# EAGLE schematic OPA_BOARD_V2 (EAGLE 7.5.0)
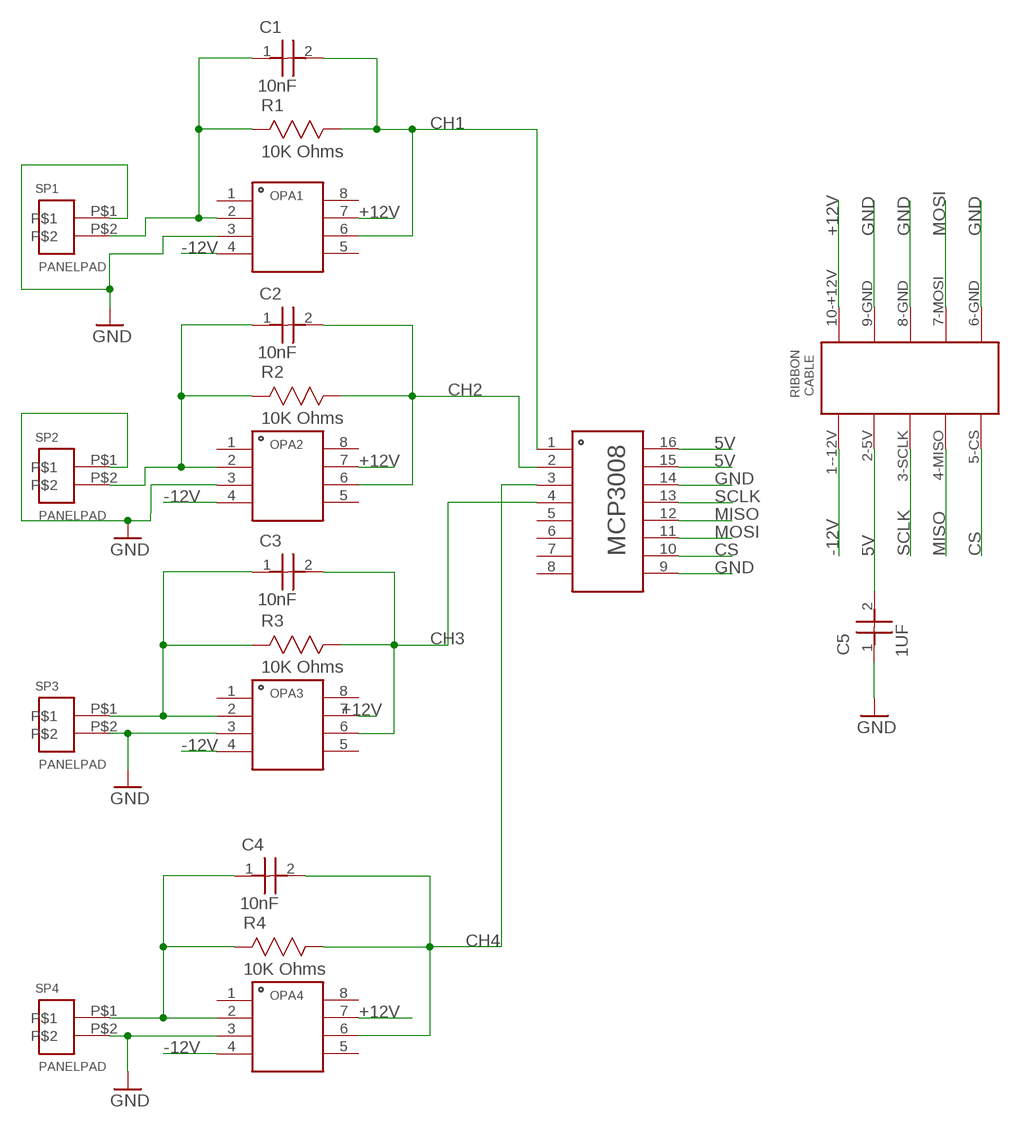
[diagram p0: schematic, sheet 1]

## Parts
ADC  MCP3008-SOIC16  [SOIC16N]
C1  10nF  CAP1206  [CAP1206]
C2  10nF  CAP1206  [CAP1206]
C3  10nF  CAP1206  [CAP1206]
C4  10nF  CAP1206  [CAP1206]
C5  1UF  CAP1206  [CAP1206]
OPA1  THS4631-SOIC8  [SOIC8]
OPA2  THS4631-SOIC8  [SOIC8]
OPA3  THS4631-SOIC8  [SOIC8]
OPA4  THS4631-SOIC8  [SOIC8]
R1  10K Ohms  RES1206  [RES1206]
R2  10K Ohms  RES1206  [RES1206]
R3  10K Ohms  RES1206  [RES1206]
R4  10K Ohms  RES1206  [RES1206]
SP1  PANELPAD  [PANELPADS]
SP2  PANELPAD  [PANELPADS]
SP3  PANELPAD  [PANELPADS]
SP4  PANELPAD  [PANELPADS]
U$1  5X2RIBBONCONNECTOR  [5X2RIBBONCONNECTOR]

## Nets
5V: ADC.15(15-VREF) ADC.16(16-VDD) C5.2 U$1.2-5V
+12V: OPA1.7(7-VS+) OPA2.7(7-VS+) OPA3.7(7-VS+) OPA4.7(7-VS+) U$1.10-+12V
-12V: OPA1.4(4-VS-) OPA2.4(4-VS-) OPA3.4(4-VS-) OPA4.4(4-VS-) U$1.1--12V
CH1: ADC.1(1-CH0) C1.2 OPA1.6(6-VOUT) R1.1
CH2: ADC.2(2-CH1) C2.2 OPA2.6(6-VOUT) R2.1
CH3: ADC.4(4-CH3) C3.2 OPA3.6(6-VOUT) R3.1
CH4: ADC.3(3-CH2) C4.2 OPA4.6(6-VOUT) R4.1
CS: ADC.10(10-CS) U$1.5-CS
GND: ADC.9(9-DGND) ADC.14(14-AGND) C5.1 OPA1.3(3-VIN+) OPA2.3(3-VIN+) OPA3.3(3-VIN+) OPA4.3(3-VIN+) SP1.P$1 SP2.P$1 SP3.P$2 SP4.P$2 U$1.6-GND U$1.8-GND U$1.9-GND
MISO: ADC.12(12-DOUT) U$1.4-MISO
MOSI: ADC.11(11-DIN) U$1.7-MOSI
N$2: C3.1 OPA3.2(2-VIN-) R3.2 SP3.P$1
N$4: C4.1 OPA4.2(2-VIN-) R4.2 SP4.P$1
N$6: C2.1 OPA2.2(2-VIN-) R2.2 SP2.P$2
N$9: C1.1 OPA1.2(2-VIN-) R1.2 SP1.P$2
SCLK: ADC.13(13-CLK) U$1.3-SCLK
Unconnected: ADC.5(5-CH4) ADC.6(6-CH5) ADC.7(7-CH6) ADC.8(8-CH7) OPA1.1(1-NC) OPA1.5(5-NC) OPA1.8(8-NC) OPA2.1(1-NC) OPA2.5(5-NC) OPA2.8(8-NC) OPA3.1(1-NC) OPA3.5(5-NC) OPA3.8(8-NC) OPA4.1(1-NC) OPA4.5(5-NC) OPA4.8(8-NC)

## Library data of the parts
ADC = RSC-16:MCP3008-SOIC16
C1-C4 = RSC-16:CAP1206: CAPACITOR, 1206; MPN: C1206C103K5RACTU; OC_FARNELL: 1414713; OC_NEWARK: 61H7741; SUPPLIER: Kemet; TOLERANCE: ±10%; VOLTAGERATING: 50V
C5 = RSC-16:CAP1206: CAPACITOR, 1206; MPN: C1206C103K5RACTU; OC_FARNELL: 1414713; OC_NEWARK: 61H7741; SUPPLIER: Kemet; TOLERANCE: ±10%; VALUE: 10nF; VOLTAGERATING: 50V
OPA1-OPA4 = RSC-16:THS4631-SOIC8
R1-R4 = RSC-16:RES1206: RESISTOR, 1206; MPN: CRCW120610K0FKEA; OC_FARNELL: 1469970; OC_NEWARK: 53K1907; SUPPLIER: Vishay; TOLERANCE: ±1%; WATTAGE: 0.25W
SP1-SP4 = RSC-16:PANELPAD
U$1 = RSC-16:5X2RIBBONCONNECTOR